# EAGLE design hart module (EAGLE 9.5.2)
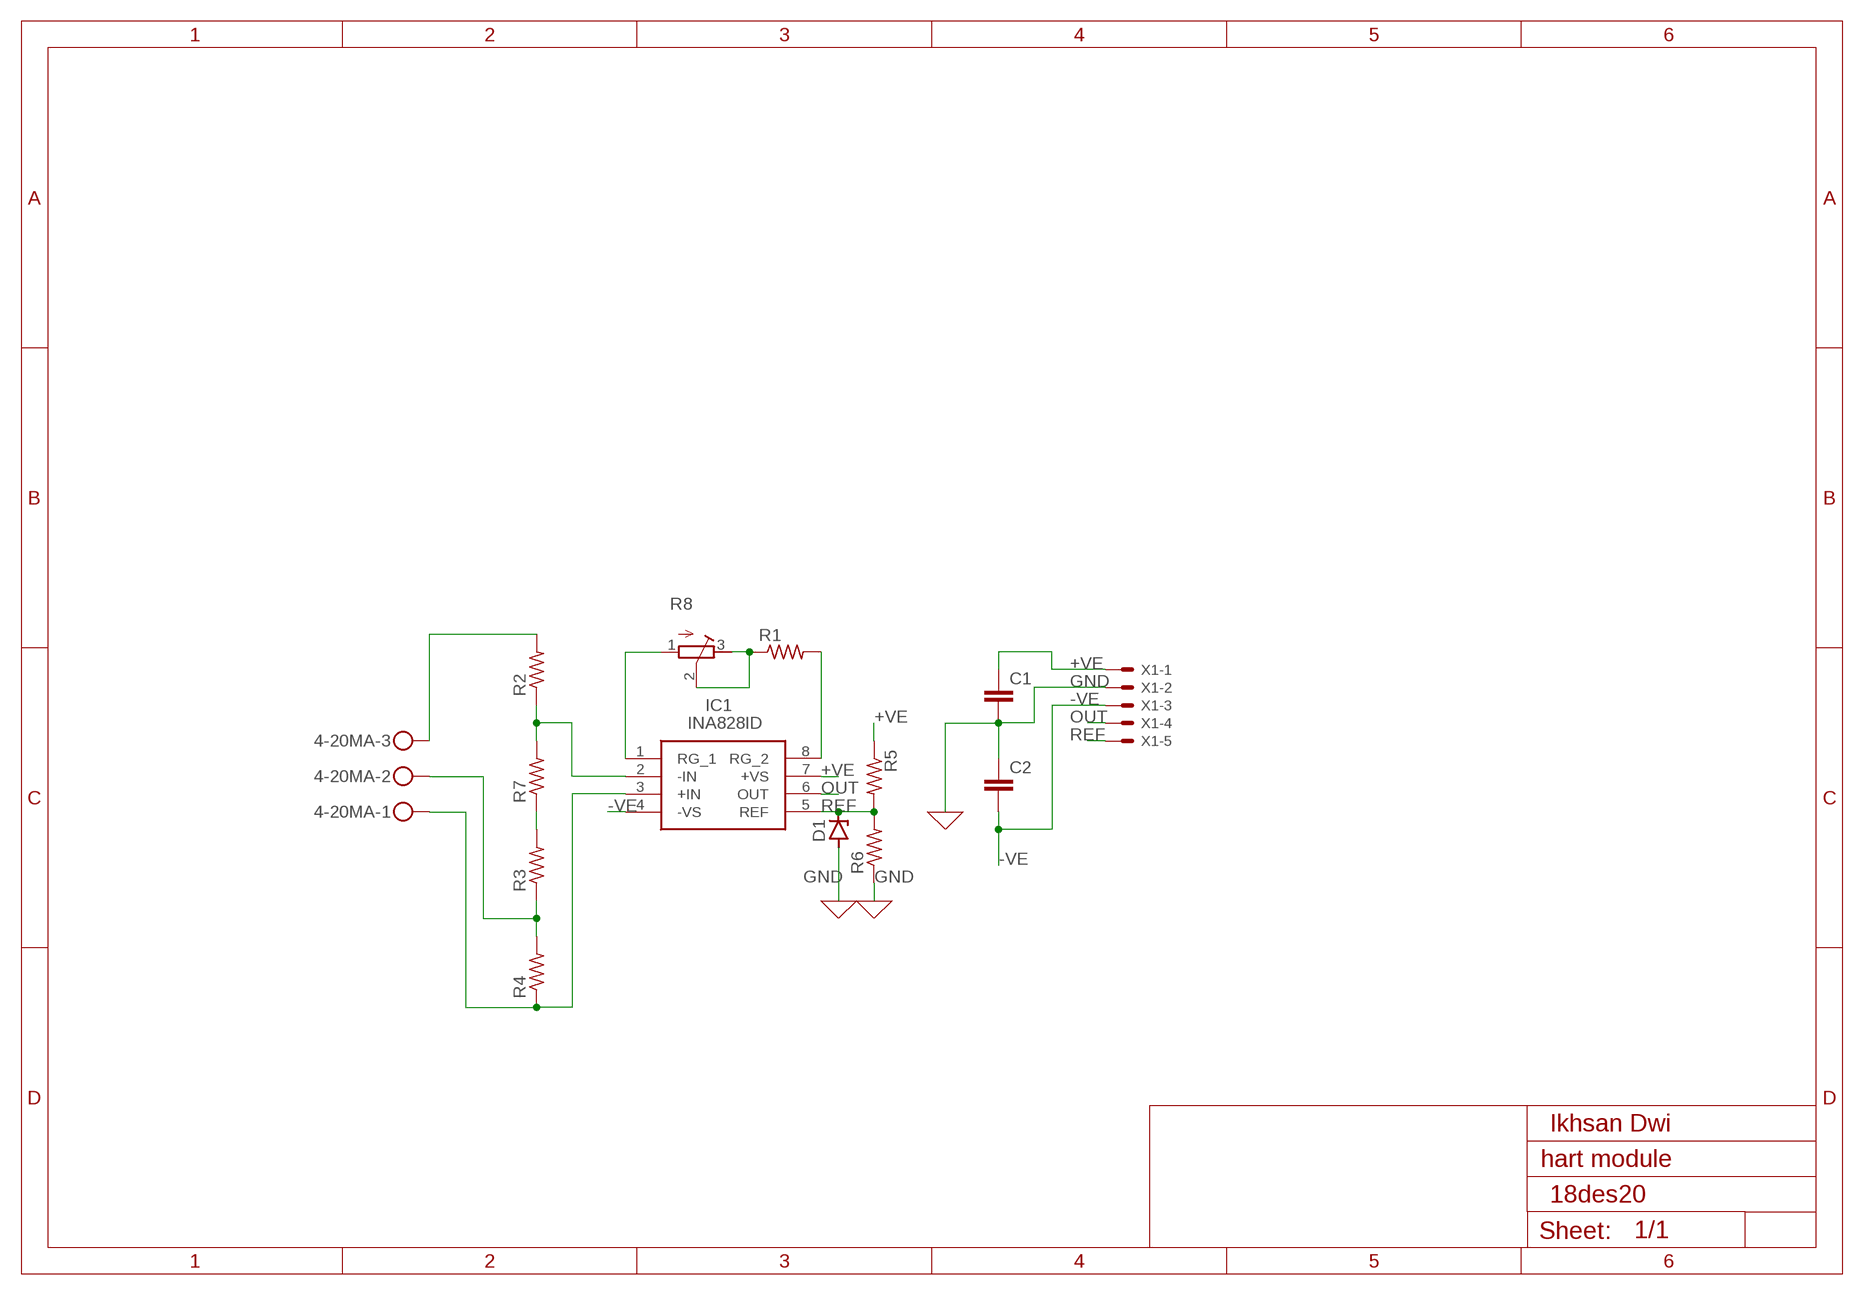
[diagram p0: schematic, sheet 1]

## Parts
4-20MA  MKDSN1,5/3-5,08  [MKDSN1,5/3-5,08]
C1  C-EU025-025X050  [C025-025X050]
C2  C-EU025-025X050  [C025-025X050]
D1  ZENER-DIODEDO35Z10  [DO35Z10]
IC1  INA828ID  [SOIC127P600X175-8N]
R1  R-US_R1206W  [R1206W]
R2  R-US_R1206W  [R1206W]
R3  R-US_R1206W  [R1206W]
R4  R-US_R1206W  [R1206W]
R5  R-US_R1206W  [R1206W]
R6  R-US_R1206W  [R1206W]
R7  R-US_R1206W  [R1206W]
R8  R-TRIMM3339P  [RTRIM3339P]
X1  22-23-2051  [22-23-2051]

## Nets
+VE: C1.1 IC1.7(+VS) R5.1 X1.1
-VE: C2.2 IC1.4(-VS) X1.3
GND: C1.2 C2.1 D1.A R6.1 X1.2
N$1: R1.1 R8.2(S) R8.3(E)
N$2: IC1.2(-IN) R2.1 R7.2
N$3: R3.2 R7.1
N$4: 4-20MA.2 R3.1 R4.2
N$6: 4-20MA.3 R2.2
N$7: 4-20MA.1 IC1.3(+IN) R4.1
N$11: IC1.1(RG_1) R8.1(A)
N$13: IC1.8(RG_2) R1.2
OUT: IC1.6(OUT) X1.4
REF: D1.C IC1.5(REF) R5.2 R6.2 X1.5

## Notes on the sheet
- Ikhsan Dwi
- 18des20

## Library data of the parts
4-20MA = con-phoenix-508:MKDSN1,5/3-5,08: MKDSN 1,5/ 3-5,08 Printklemme Nennstrom: 13,5 A Nennspannung: 250 V Rastermaß: 5,08 mm Polzahl: 3 Anschlussart: Schraubanschluss Montage: Löten Anschlussrichtung Leiter/Platine: 0 ° Artikelnummer: 1729131 Source: http://eshop.phoenixcontact.com .. 1729131.pdf
C1 C2 = rcl:C-EU: CAPACITOR, European symbol; SPICEPREFIX: C
D1 = diode:ZENER-DIODE: Z-Diode
IC1 = INA828ID:INA828ID: 50-uV Offset, 7-nV/Hz Noise, Low-Power, Precision Instrumentation Amplifier Source: Datasheet <http://www.ti.com/general/docs/lit/getliterature.tsp?genericPartNumber=ina828&fileType=pdf>; ARROW_PART_NUMBER: INA828ID; ARROW_PRICE-STOCK: https://www.arrow.com/en/products/ina828id/texas-instruments; DESCRIPTION: 50-uV Offset, 7-nV/Hz Noise, Low-Power, Precision Instrumentation Amplifier; HEIGHT: 1.75mm; MANUFACTURER_NAME: Texas Instruments; MANUFACTURER_PART_NUMBER: INA828ID; MOUSER_PART_NUMBER: 595-INA828ID; MOUSER_PRICE-STOCK: https://www.mouser.co.uk/ProductDetail/Texas-Instruments/INA828ID?qs=YCa%2FAAYMW022JAggZ%252B%2F2Sw%3D%3D
R1-R7 = rcl:R-US_: RESISTOR, American symbol; SPICEPREFIX: R
R8 = rcl:R-TRIMM: Trimm resistor; SPICEMODEL: X; SPICEPREFIXL: POT
X1 = con-molex:22-23-2051: .100" (2.54mm) Center Header - 5 Pin; MF: MOLEX; MPN: 22-23-2051; OC_FARNELL: 1462952; OC_NEWARK: 38C9178

## Board
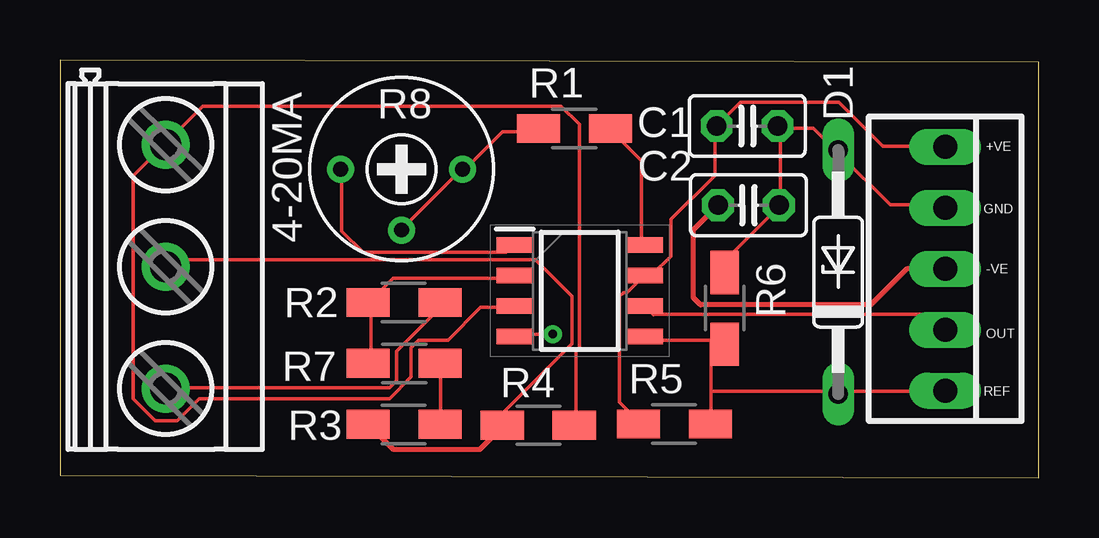
[diagram p1: board, top side]
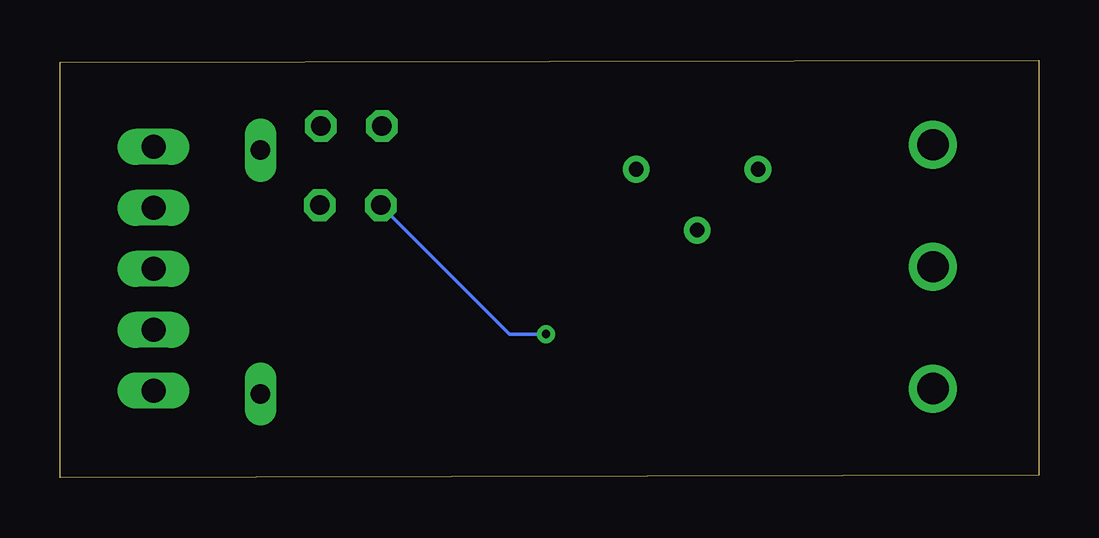
[diagram p2: board, bottom side, seen from below]

Size 40.8 x 17.4 mm. Coordinates in mm from the lower left corner, seen from the top.
Outline: 0,0.1 40.8,0 40.8,17.3 0,17.4 0,0.1
Copper layers (1*16): Top 0.035mm / dielectric 1.5mm / Bottom 0.035mm
Design rules "default": minimum track width 6mil, minimum drill 0.35mm, track to track 6mil, track to pad 6mil, pad to pad 6mil, via to via 6mil, smd to smd 6mil, copper to edge 40mil, drill to drill 6mil, minimum pad ring 10mil, minimum via ring 8mil, stop-mask expansion 4mil, vias tented up to drill 0mil, thermal gap 10mil

### Footprints (pad centres in the part's own frame; a part is rotated, then mirrored left to right if it is on the bottom)
MKDSN1,5/3-5,08 = drill 1.3 pad 2: 1 -7.641,0.025; 2 -2.561,0.025; 3 2.519,0.025
C025-025X050 = drill 0.813 octagon: 1 -1.27,0; 2 1.27,0
DO35Z10 = drill 0.813 long: A 5.08,0; C -5.08,0
SOIC127P600X175-8N = smd 1.525 x 0.65: 1 -2.712,1.905; 2 -2.712,0.635; 3 -2.712,-0.635; 4 -2.712,-1.905; 5 2.712,-1.905; 6 2.712,-0.635; 7 2.712,0.635; 8 2.712,1.905
R1206W = smd 1.8 x 1.2: 1 -1.499,0; 2 1.499,0
RTRIM3339P = drill 0.61: 1 -2.54,0; 2 0,-2.54; 3 2.54,0
22-23-2051 = drill 1 long: 1 -5.08,0; 2 -2.54,0; 3 0,0; 4 2.54,0; 5 5.08,0

### Placement (x,y rotation side)
4-20MA  4.38,6.23 270 top
C1  28.65,14.65 0 top
C2  28.7,11.35 180 top
D1  32.44,8.56 90 top
IC1  21.67,7.78 0 top
R1  21.45,14.55 0 top
R2  14.34,7.3 0 top
R3  14.34,2.22 0 top
R4  19.94,2.18 180 top
R5  25.61,2.23 0 top
R6  27.71,7.05 270 top
R7  14.34,4.76 180 top
R8  14.24,12.85 0 top
X1  36.9,8.7 270 top

### Tracks (layer width: path | path; a pad name or v marks a point on that pad's centre or on a via)
+VE
  Top 0.152: R5.1 24.09,2.37 23.33,3.13 23.33,7.55 23.48,7.71 23.64,7.71 24.25,8.32 IC1.7 24.4,8.47 24.7,8.47 25.46,9.23 25.46,10.75 27.29,12.58 27.29,14.56 C1.1 27.45,14.72 28.36,15.63 32.48,15.63 34.3,13.8 36.9,13.8 X1.1
-VE  (via drill 0.35)
  Top 0.152: v20.54,5.98 19.06,5.98 IC1.4
  Top 0.2: X1.3 35.3,8.7 33.8,7.2 26.7,7.2 26.4,7.5 26.4,10.32 C2.2
  Bottom 0.152: v20.54,5.98 22.06,5.98 27.29,11.21 C2.2
GND
  Top 0.152: R6.1 27.75,8.62 27.75,9.08 29.89,11.21 C2.1 30.04,11.36 30.04,14.56 | 30.04,14.56 31.41,14.56 32.32,13.65 D1.A 32.48,13.5 34.61,11.36 36.9,11.36 X1.2 | 30.04,14.56 C1.2
N$1
  Top 0.152: R1.1 19.83,14.41 18.46,14.41 16.93,12.89 R8.3 16.78,12.89 14.34,10.45 R8.2
N$2
  Top 0.152: IC1.2 18.91,8.32 13.88,8.32 12.97,7.4 R2.1 12.97,7.25 12.97,4.81 R7.2
N$3
  Top 0.152: R3.2 15.86,2.22 15.86,4.66 R7.1
N$4
  Top 0.152: R4.2 18.46,2.22 18.46,2.68 21.35,5.57 21.35,7.55 19.83,9.08 4.59,9.08 4.43,8.93 4-20MA.2
  Top 0.2: R3.1 13.88,1.18 17.5,1.17 18.44,2.11 R4.2
N$6
  Top 0.152: R2.2 15.71,7.25 15.71,6.94 14.04,5.27 14.04,4.05 13.73,3.74 4.43,3.74 4-20MA.3
N$7
  Top 0.152: IC1.3 18.91,7.1 17.54,7.1 16.17,5.73 14.95,5.73 14.64,5.42 14.64,4.2 13.73,3.29 5.81,3.29 4.89,2.37 3.98,2.37 3.06,3.29 3.06,12.58 4.28,13.8 4-20MA.1 4.43,13.96 5.96,15.48 20.89,15.48 21.66,14.72 21.66,5.42 21.5,5.27 21.5,2.22 R4.1
N$11
  Top 0.152: IC1.1 18.91,9.54 18.75,9.54 18.59,9.38 12.63,9.38 11.75,10.27 11.75,12.74 R8.1
N$13
  Top 0.152: IC1.8 24.25,9.69 24.25,13.19 23.03,14.41 R1.2
OUT
  Top 0.152: IC1.6 24.74,6.79 24.73,6.8 36.28,6.8 36.9,6.18 X1.4
REF
  Top 0.152: 27.14,5.73 27.45,5.73 27.6,5.57 R6.2 27.14,5.73 | 27.14,5.73 24.4,5.73 IC1.5 | 27.14,5.73 27.14,3.59 | 27.14,3.59 27.14,2.37 R5.2 | X1.5 36.9,3.59 32.48,3.59 D1.C 32.32,3.59 27.14,3.59

### Text on the board
tPlace: +VE | GND | -VE | OUT | REF